# Altium schematic sheet Power_Supply.SchDoc
size A; SheetNumber: 8; SheetTotal: 8
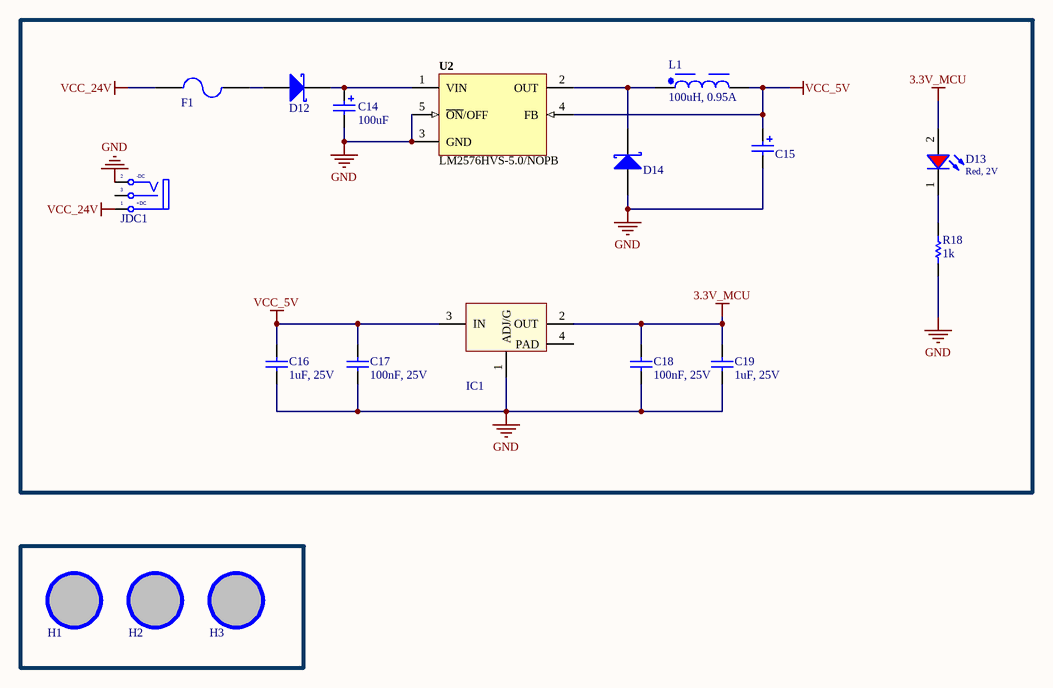
[diagram p0: Power_Supply.SchDoc]

## Parts
C14  100uF  [WCAP-ATG8_D8H11.5]
C15  1000uF  [WCAP-ATG8_D13H25]  (value not drawn)
C16  1uF, 25V  [WCAP-CSGP_0603_H=0.8mm_Reflow]
C17  100nF, 25V  [WCAP-CSGP_0603_H=0.8mm_Reflow]
C18  100nF, 25V  [WCAP-CSGP_0603_H=0.8mm_Reflow]
C19  1uF, 25V  [WCAP-CSGP_0603_H=0.8mm_Reflow]
D12  SS34  [SS34]  (value not drawn)
D13  Red, 2V  [WL-SMCW_0603_H=0.7mm]
D14  SS34  [SS34]  (value not drawn)
F1  0ZCG0150BF2C  [FUSE SMD]  (value not drawn)
H1  Hole  [LO KHOAN 3MM]  (value not drawn)  (no BOM)
H2  Hole  [LO KHOAN 3MM]  (value not drawn)  (no BOM)
H3  Hole  [LO KHOAN 3MM]  (value not drawn)  (no BOM)
IC1  LM1117IMP-3.3/NOPB  [SOT223-4N]  (value not drawn)
JDC1  G-014-4  [DC-IN]  (value not drawn)
L1  100uH, 0.95A  [WE-PD2SR_7850]
R18  value 1k  [RES-SM-0603]  (hidden comment: ESR03EZPJ102)
U2  LM2576HVS-5.0/NOPB  [TO263]

## Nets
3.3V_MCU: C18.2 C19.2 D13.2(A) IC1.2(OUT)
GND: C14.2(N) C15.2(N) C16.1 C17.1 C18.1 C19.1 D14.1(A) IC1.1(ADJ/G) JDC1.2(TN) R18.1 U2.3(GND) U2.5(~{ON}/OFF)
VCC_5V: C15.1(P) C16.2 C17.2 IC1.3(IN) L1.2 U2.4(FB)
VCC_24V: F1.1 JDC1.1(T)
NetC14_1: C14.1(P) D12.2(K) U2.1(VIN)
NetD12_1: D12.1(A) F1.2
NetD13_1: D13.1(K) R18.2
NetD14_2: D14.2(K) L1.1 U2.2(OUT)

Not connected (* = marked no-connect by the designer): H1 1; H2 1; H3 1; IC1 4(PAD); JDC1 3(S)

## Notes on the sheet
- (in symbol Jack DC) -DC; +DC

## Library data of the parts
C14 = 860010674014: WCAP-ATG8 Aluminum Electrolytic Capacitor, Radial THT, D8xH11.5mm, 100uF, 50V; Manufacturer: Wurth Elektronik; Capacitance Tolerance: +/-20%; Dissipation Factor: 10%; Endurance: 2000h; Leakage Current: 50uA; Ripple Current: 286mA; Technical Reference: ATBE115101M050DSPA7B000; No. Pad (SMD): 0; No. Pad (THT): 2; ComponentLink1Description: Manufacturer Link; ComponentLink1URL: https://www.we-online.com/redexpert/article/860010674014?ad; ComponentLink2Description: Datasheet; ComponentLink2URL: https://www.we-online.com/redexpert/spec/860010674014?ad; Category: Aluminum Electrolytic Capacitors; Match Code: WCAP-ATG8; Manufacturer Part Number: 860010674014; Mount: Through Hole; Operating Temperature Max: 85°C; Operating Temperature Min: -40°C; Packaging: Ammo Pack; Height: 11.5mm; Diameter: 8mm; Capacitance: 100uF; Rated Voltage (DC): 50V; Unit Price (Digikey): 0.28
C15 = 860010678024: WCAP-ATG8 Aluminum Electrolytic Capacitor, Radial THT, D13xH25mm, 1000uF, 50V; Manufacturer: Wurth Elektronik; Capacitance Tolerance: +/-20%; Dissipation Factor: 10%; Endurance: 2000h; Leakage Current: 500uA; Ripple Current: 1485mA; Technical Reference: ATBI250102M050DSPACB000; No. Pad (SMD): 2; No. Pad (THT): 0; ComponentLink1Description: Manufacturer Link; ComponentLink1URL: https://www.we-online.com/redexpert/article/860010678024?ad; ComponentLink2Description: Datasheet; ComponentLink2URL: https://www.we-online.com/redexpert/spec/860010678024?ad; Category: Aluminum Electrolytic Capacitors; Match Code: WCAP-ATG8; Manufacturer Part Number: 860010678024; Mount: Through Hole; Operating Temperature Max: 85°C; Operating Temperature Min: -40°C; Packaging: Ammo Pack; Height: 25mm; Diameter: 13mm; Capacitance: 1000uF; Rated Voltage (DC): 50V; Unit Price (Digikey): 1.43
C16 C19 = 885012106022: WCAP-CSGP Multilayer Ceramic Chip Capacitor, General Purpose, size 0603, X5R, 1uF, 25V; Manufacturer: Wurth Elektronik; Rated Voltage: 25VDC; Isolation Resistance: >=0.5GOhm; Capacitance Tolerance: +/-20%; Technical Reference: X5R0603105M025DFCT10000; No. Pad (SMD): 2; No. Pad (THT): 0; ComponentLink1Description: Manufacturer; ComponentLink1URL: http://www.we-online.de; ComponentLink2Description: Datasheet; ComponentLink2URL: https://www.we-online.com/catalog/datasheet/885012106022.pdf; Operating Temperature: -55 to +85degC; Packaging: Tape and Reel; Manufacturer Part Number: 885012106022; Published Date: May 2020; Ceramic Type: X5R; Dissipation Factor: =<10%; Height: 0.8mm; Mounting Technology: SMT; Size: 0603; Capacitance: 1uF; Unit Price (Digikey): 0.43
C17 C18 = 885012206071: WCAP-CSGP Multilayer Ceramic Chip Capacitor, General Purpose, size 0603, X7R, 100nF, 25V; Manufacturer: Wurth Elektronik; Rated Voltage: 25VDC; Isolation Resistance: >=5GOhm; Capacitance Tolerance: +/-10%; Technical Reference: X7R0603104K025DFCT10000; No. Pad (SMD): 2; No. Pad (THT): 0; ComponentLink1Description: Manufacturer; ComponentLink1URL: http://www.we-online.de; ComponentLink2Description: Datasheet; ComponentLink2URL: https://www.we-online.com/catalog/datasheet/885012206071.pdf; Operating Temperature: -55 to +125degC; Packaging: Tape and Reel; Manufacturer Part Number: 885012206071; Published Date: May 2020; Ceramic Type: X7R; Dissipation Factor: =<3.5%; Height: 0.8mm; Mounting Technology: SMT; Size: 0603; Capacitance: 100nF; Unit Price (Digikey): 0.1
D12 D14 = D Schottky: DIODE SCHOTTKY 40V 3A SMC; Mfr: onsemi; Voltage - Forward (Vf) (Max) @ If: 500 mV @ 3 A; Speed: Fast Recovery =< 500ns, > 200mA (Io); Current - Reverse Leakage @ Vr: 500 µA @ 40 V; No. Pad (SMD): 2; No. Pad (THT): 0; Published: 8-Jun-2000; LatestRevisionDate: 17-Jul-2002; LatestRevisionNote: Re-released for DXP Platform.; PackageReference: SMB; Publisher: Altium Limited; PackageDescription: DO-214-AA/SMB; 2 C-Bend Leads; Body 5.3 x 3.6 mm, inc. leads (LxW); Code_JEDEC: DO-214-AA; Category: Discrete Semiconductor Products; Diode Type: Schottky; Voltage - DC Reverse (Vr) (Max): 40 V; Current - Average Rectified (Io): 3A; Mounting Type: Surface Mount; Package / Case: DO-214AB, SMC; Supplier Device Package: SMC (DO-214AB); Operating Temperature - Junction: -55°C ~ 150°C; Base Product Number: SS34; Unit Price (Digikey): 0.65
D13 = 150060RS75000: WL-SMCW SMT Mono-color Chip LED Waterclear, size 0603, Red, 2V, 140deg; Chip Technology: AlInGaP; Dominant Wavelength typ.: 625nm; Luminous Intensity typ.: 250mcd; Peak Wavelength typ.: 630nm; No. Pad (SMD): 2; No. Pad (THT): 0; Viewing Angle: 140deg; ComponentLink1Description: Manufacturer; ComponentLink1URL: http://www.we-online.de; ComponentLink2URL: https://www.we-online.com/catalog/datasheet/150060RS75000.pdf; ComponentLink2Description: Datasheet; Forward Voltage typ.: 2V; Emitting Color: Red; Mounting Technology: SMT; Operating Temperature: -40 to +85degC; Published Date: December 2019; Part Number: 150060RS75000; Packaging: Tape and Reel; Size: 0603; Publisher: Wurth Elektronik; Unit Price (Digikey): 0.15
F1 = Fuse: PTC RESET FUSE 24V 1.5A 1812; Mfr: Bel Fuse Inc.; Type: Polymeric; Current - Max: 100 A; Current - Trip (It): 3 A; Time to Trip: 1.5 s; Resistance - Initial (Ri) (Min): 40 mOhms; Resistance - Post Trip (R1) (Max): 120 mOhms; Approval Agency: AEC-Q200, cURus, TUV; No. Pad (SMD): 2; No. Pad (THT): 0; Category: Circuit Protection; Series: 0ZCG; Voltage - Max: 24V; Current - Hold (Ih) (Max): 1.5 A; Operating Temperature: -40°C ~ 85°C; Ratings: AEC-Q200; Mounting Type: Surface Mount; Package / Case: 1812 (4532 Metric), Concave; Size / Dimension: 0.179" L x 0.128" W (4.55mm x 3.24mm); Thickness (Max): 0.061" (1.55mm); Unit Price (Digikey): 0.23
H1-H3 = Hole: Hole 3mm
IC1 = LM1117: IC REG LINEAR 3.3V 800MA SOT223; Mfr: Texas Instruments; Value: LM317; Output Configuration: Positive; Output Type: Fixed; Number of Regulators: 1; Voltage - Input (Max): 15V; Voltage Dropout (Max): 1.2V @ 800mA; Current - Quiescent (Iq): 5 mA; Current - Supply (Max): 10 mA; PSRR: 75dB (120Hz); Protection Features: Over Current, Over Temperature; No. Pad (SMD): 4; No. Pad (THT): 0; Category: Integrated Circuits (ICs); Series: LM1117-3.3; Voltage - Output (Min/Fixed): 3.3V; Current - Output: 800mA; Operating Temperature: -40°C ~ 125°C; Mounting Type: Surface Mount; Package / Case: TO-261-4, TO-261AA; Supplier Device Package: SOT-223; Base Product Number: LM1117; Unit Price (Digikey): 1.41
JDC1 = Jack DC: DC POWER JACK, MATES TO 5.5 X 2.; Mfr: GlobTek, Inc.; Value: Jac DC; Gender: Male; Industry Recognized Mating Diameter: 2.10mm ID (0.083"), 5.50mm OD (0.217"); Actual Diameter: 0.083" (2.10mm ID), 0.217" (5.50mm OD); Number of Positions/Contacts: 2 Conductors, 3 Contacts; Internal Switch(s): Single Switch; Shielding: Shielded; Voltage - Rated: 24VDC; Current Rating (Amps): 5 A; No. Pad (SMD): 0; No. Pad (THT): 3; ComponentLink1Description: Digikey; ComponentLink1URL: https://www.digikey.com/en/products/detail/globtek-inc/G-014-4/16515767?s=N4IgjCBcpgLFoDGUBmBDANgZwKYBoQB7KAbXAFZywAOAZhALEoCYB2eRl6iR62ANn4AGEAF0CABwAuUEAGUpAJwCWAOwDmIAL4FmATgQhkkdNnxFSIWqzBxWYyTMjylazTvB7y8aEdSZcAmJIMjBmWCE9EXEQaVkFFQ1tAgBaZkNjJQBXc2CycjEtD3SQkAApNEQAawACABEAYUKgA; Connector Type: Jack; Mounting Type: Through Hole, Right Angle; Termination: Kinked Pin, Solder; Insulation Color: Black; Contact Material - Plating: Nickel; Housing Material: Polybutylene Terephthalate (PBT), Glass Filled; Contact Material: Brass; Unit Price (Digikey): 1.02
L1 = 744787101: WE-PD2SR SMT Power Inductor, size 7850, 100uH, 0.95A, 467mOhm; Manufacturer: Wurth Elektronik; Self Resonant Frequency: 5MHz; DC Resistance typ.: 396mOhm; Saturation Current: 0.87A; No. Pad (SMD): 2; No. Pad (THT): 0; ComponentLink1Description: Manufacturer; ComponentLink1URL: http://www.we-online.de; ComponentLink2Description: Datasheet; ComponentLink2URL: https://www.we-online.com/catalog/datasheet/744787101.pdf; Mounting Technology: SMT; Operating Temperature: -40 to +125degC; Packaging: Tape and Reel; Height: 5mm; DC Resistance max.: 467mOhm; Inductance: 100uH; Manufacturer Part Number: 744787101; Rated Current: 0.95A; Size: 7850; Length: 7.8mm; Width: 7mm; Unit Price (Digikey): 1.95
R18 = RESISTOR SMD: RES SMD 1K OHM 5% 1/4W 0603; Mfr: Rohm Semiconductor; Resistance: 1 kOhms; Power (Watts): 0.25W, 1/4W; Temperature Coefficient: ±200ppm/°C; No. Pad (SMD): 2; No. Pad (THT): 0; Category: Resistors; Series: ESR; Tolerance: ±5%; Composition: Thick Film; Features: Automotive AEC-Q200, Pulse Withstanding; Operating Temperature: -55°C ~ 155°C; Package / Case: 0603 (1608 Metric); Supplier Device Package: 0603; Ratings: AEC-Q200; Size / Dimension: 0.063" L x 0.031" W (1.60mm x 0.80mm); Height - Seated (Max): 0.022" (0.55mm); Number of Terminations: 2; Unit Price (Digikey): 0.14
U2 = LM2576: IC REG BUCK 5V 3A TO263-5; Max Input Voltage: 12 V; Max Output Current: 3 (6.0 peak) A; Max Output Voltage: mV; No. Pad (SMD): 6; No. Pad (THT): 0; Category: IC-Power; Min Input Voltage: mV; Min Output Voltage: mV; Mounting Technology: Surface Mount; Status: Unreleased; Supply Voltage: mV; Temperature Range: -40 to +125 degC; Unit Price (Digikey): 9.24